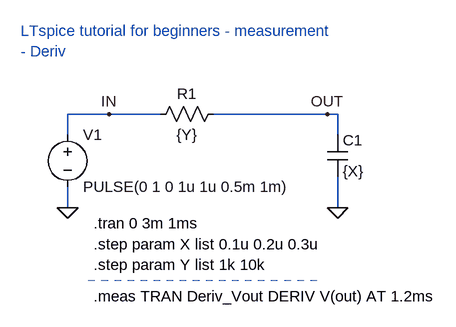
[diagram p0: schematic LTspice 02-4 meas deriv.asc]
LTspice 02-4 meas deriv.asc, the LTspice schematic file:
Version 4
SHEET 1 880 680
WIRE 144 80 80 80
WIRE 224 80 144 80
WIRE 480 80 304 80
WIRE 496 80 480 80
WIRE 80 112 80 80
WIRE 496 112 496 80
WIRE 80 224 80 192
WIRE 496 224 496 176
FLAG 80 224 0
FLAG 496 224 0
FLAG 144 80 IN
FLAG 480 80 OUT
SYMBOL voltage 80 96 R0
WINDOW 123 0 0 Left 2
WINDOW 39 0 0 Left 2
SYMATTR InstName V1
SYMATTR Value PULSE(0 1 0 1u 1u 0.5m 1m)
SYMBOL res 320 64 R90
WINDOW 0 0 56 VBottom 2
WINDOW 3 32 56 VTop 2
SYMATTR InstName R1
SYMATTR Value {Y}
SYMBOL cap 480 112 R0
SYMATTR InstName C1
SYMATTR Value {X}
TEXT 8 -48 Left 2 ;LTspice tutorial for beginners - measurement\n- Deriv
TEXT 120 248 Left 2 !.tran 0 3m 1ms
TEXT 120 280 Left 2 !.step param X list 0.1u 0.2u 0.3u
TEXT 120 312 Left 2 !.step param Y list 1k 10k
TEXT 120 360 Left 2 !.meas TRAN Deriv_Vout DERIV V(out) AT 1.2ms
LINE Normal 464 336 112 336 2

The netlist it stands for:
* LTspice 02-4 meas deriv.asc
V1 IN 0 PULSE(0 1 0 1u 1u 0.5m 1m)
R1 OUT IN {Y}
C1 OUT 0 {X}
* LTspice tutorial for beginners - measurement
* - Deriv
.tran 0 3m 1ms
.step param X list 0.1u 0.2u 0.3u
.step param Y list 1k 10k
.meas TRAN Deriv_Vout DERIV V(out) AT 1.2ms
.backanno
.end